# Altium project PCB_Project.PrjPcb
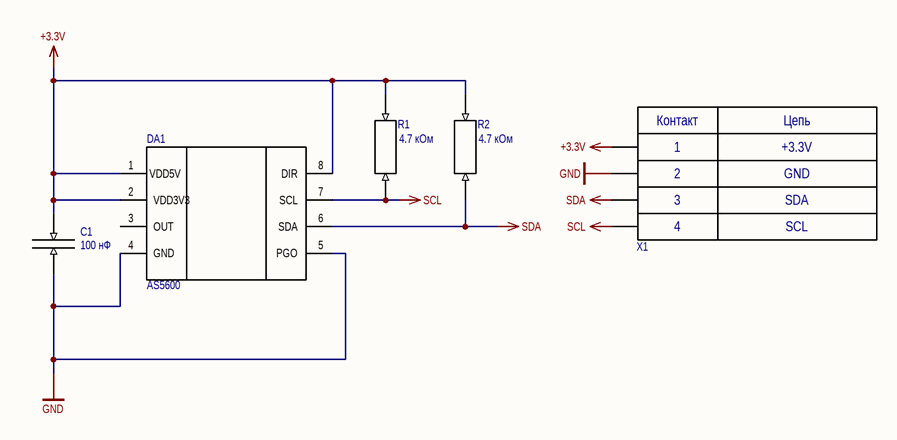
[diagram p0: Sensor_plate.SchDoc]
1 sheet, 5 parts. Net scope: global (net labels, ports and power ports of the same name join across sheets).
Board file: PCBsen.PcbDoc

## Sheet Sensor_plate.SchDoc
size 209 x 297 mm; SheetNumber: 1; SheetTotal: 1; Деци.номер: СМ7.00.02.00 Э3; название: Плата датчика положения; ФИО: Соловцов М.А.; колич: 1; орг: МГТУ им. Н.Э. Баумана; орг1: группа СМ7-71Б

### Parts
C1  value 100 нФ  [0402]  (hidden comment: Cp)
DA1  AS5600  [SOIC8]
R1  value 4.7 кОм  [0603]  (hidden comment: Resistor)
R2  value 4.7 кОм  [0603]  (hidden comment: Resistor)
X1  4pin  [4pin]  (value not drawn)

### Nets
+3.3V: C1.2 DA1.1(VDD5V) DA1.2(VDD3V3) DA1.8(DIR) R1.1 R2.2 X1.1
GND: C1.1 DA1.4(GND) DA1.5(PGO) X1.2(-Vout)
SCL: DA1.7(SCL) R1.2 X1.4(-Vout)
SDA: DA1.6(SDA) R2.1 X1.3(-Vout)

Not connected (* = marked no-connect by the designer): DA1 3(OUT)

### Notes on the sheet
- Изм
- Лист
- № докум.
- Подп.
- Дата
- Лит.
- Масса
- Масш.
- Т.контр.
- Разраб
- Пров.
- Бошляков А.А
- Схема электрическая
- принципиальная
- Листов
- Н.контр
- Утв.
- (in symbol 4pin_1) Контакт; Цепь

### Library data of the parts
C1 = Capicator
R1 R2 = Resistor: TU: ШКАБ.434110.002ТУ; Reference: *
X1 = 4pin_1: LineName1: +3.3V; LineName2: GND; LineName3: SDA; LineName4: SCL
DA1 = AS5600: Reference: https://aliexpress.ru/item/4001190146547.html?spm=a2g0o.search0302.0.0.391f12cf68ntH5&algo_pvid=4adb70b5-0f0b-41d6-8c9b-7ba1863a7116&algo_expid=4adb70b5-0f0b-41d6-8c9b-7ba1863a7116-55&btsid=0b8b035916096811941256657eb370&ws_ab_test=searchweb0_0,searchweb201602_,searchweb201603_&sku_id=10000015233570585